# Altium schematic sheet RF-Front.SchDoc: RF Front End
size Legal; CheckedBy: J. Brinton; CompanyName: Signal Laboratories, Inc.; DrawnBy: J. Brinton; Engineer: J. Brinton; Address1: 3479 Edison Way; Address2: Menlo Park CA 94025; Address3: +1 (877) 778-8435; Address4: siglabs.com; DocumentNumber: 46; Revision: 1; SheetNumber: 47; SheetTotal: 58
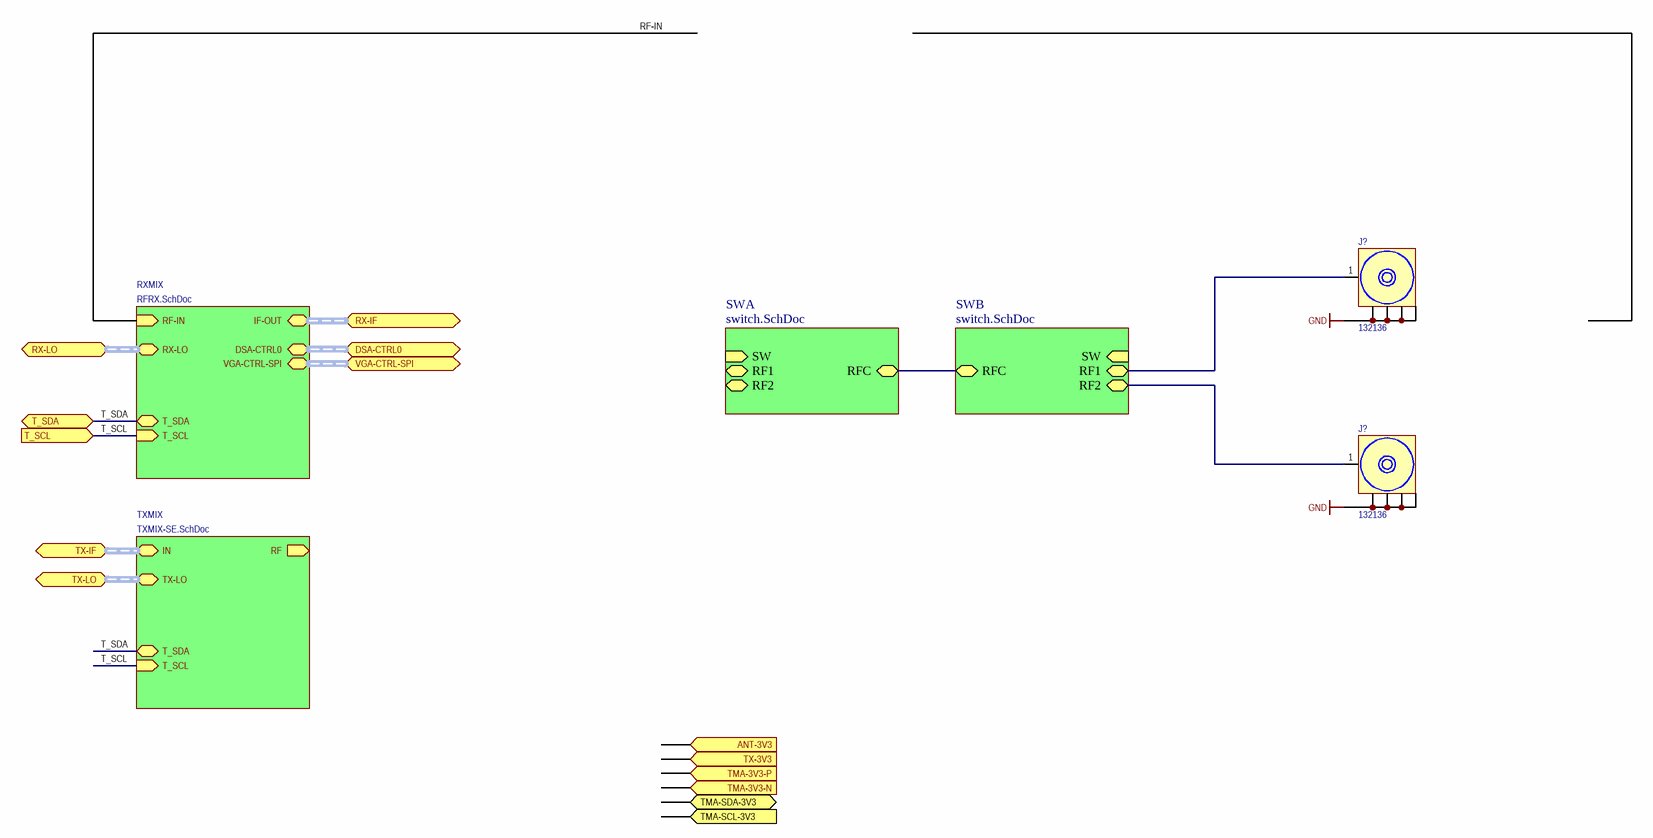
[diagram p0: RF-Front.SchDoc]

## Parts
(Parts that share a designator on the sheet are numbered #1, #2 ... from top to bottom, then left to right.)
J?#1  132136  [132136]
J?#2  132136  [132136]

## Sub-sheets
RXMIX = RFRX.SchDoc: RF-IN (in), DSA-CTRL0 (harness DSA_CTRL), VGA-CTRL-SPI (harness SPI), IF-OUT (harness DIFF100), RX-LO (harness CLK-LVDS), T_SCL (in), T_SDA (bidir)
SWA = switch.SchDoc: SW (in), RFC (bidir), RF1 (bidir), RF2 (bidir)
SWB = switch.SchDoc: SW (in), RFC (bidir), RF1 (bidir), RF2 (bidir)
TXMIX = TXMIX-SE.SchDoc: IN (harness DIFF100), RF (out), TX-LO (harness CLK-LVPECL33), T_SCL (in), T_SDA (bidir)

## Ports
ANT-3V3 (in), DSA-CTRL0 (harness DSA_CTRL), RX-IF (harness DIFF100), RX-LO (harness CLK-LVDS), T_SCL (in), T_SDA (bidir), TMA-3V3-N (in), TMA-3V3-P (in), TMA-SCL-3V3 (in), TMA-SDA-3V3 (bidir), TX-3V3 (in), TX-IF (harness DIFF100), TX-LO (harness CLK-LVPECL33), VGA-CTRL-SPI (harness SPI)

## Nets
GND: J?#1.2(GND) J?#1.3(GND) J?#1.4(GND) J?#1.5(GND) J?#2.2(GND) J?#2.3(GND) J?#2.4(GND) J?#2.5(GND)
RF-IN: sheet RXMIX/RF-IN
T_SCL: port T_SCL, sheet RXMIX/T_SCL, sheet TXMIX/T_SCL
T_SDA: port T_SDA, sheet RXMIX/T_SDA, sheet TXMIX/T_SDA
NetJ?#1_1: J?#1.1(CENTER) ; sheet SWB/RF1
NetJ?#2_1: J?#2.1(CENTER) ; sheet SWB/RF2
(unnamed): sheet SWA/RFC, sheet SWB/RFC

## Buses and harness runs
harness port DSA-CTRL0 = sheet RXMIX/DSA-CTRL0
harness port RX-IF = sheet RXMIX/IF-OUT
harness port RX-LO = sheet RXMIX/RX-LO
harness port TX-IF = sheet TXMIX/IN
harness port TX-LO = sheet TXMIX/TX-LO
harness port VGA-CTRL-SPI = sheet RXMIX/VGA-CTRL-SPI

## Notes on the sheet
- Title
- Engineer
- Revision
- Drawn By
- Checked By
- Date
- Sheet
- of

## Library data of the parts
J?#1 J?#2 = 132136: SMA Right Angle Connector COAX Female; Manufacturer: Amphenol; Manufacturer P/N: 132136